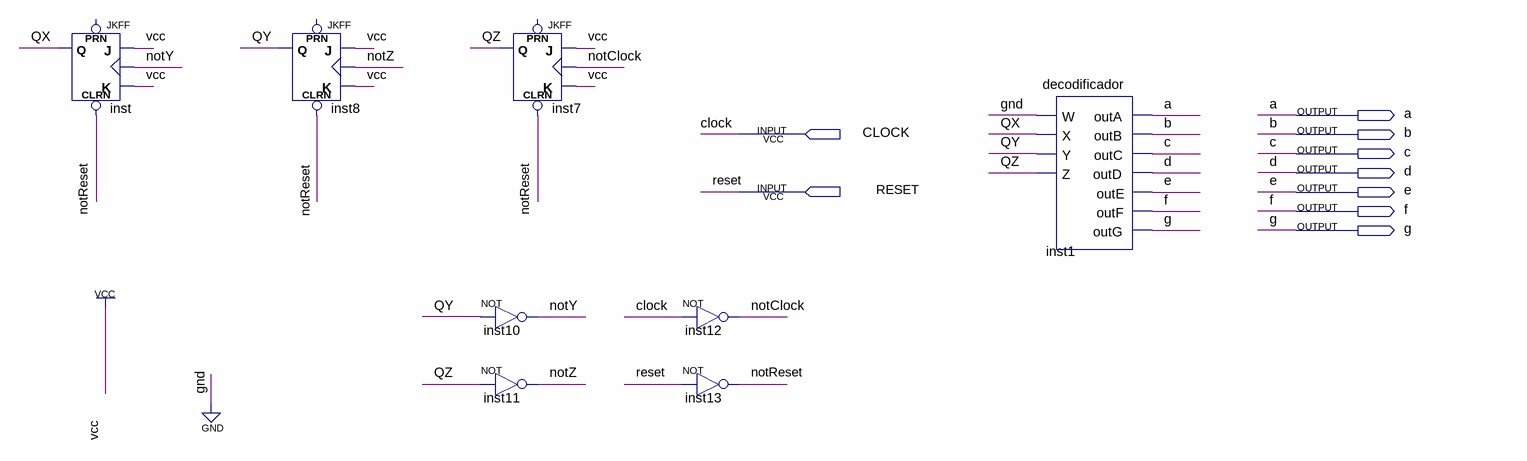
[diagram p0: schematic sheet]
// Quartus schematic ass.bdf as structural Verilog: 8 symbols, 9 pins
module ass (
  input  CLOCK,
  input  RESET,
  output a,
  output b,
  output c,
  output d,
  output e,
  output f,
  output g
);

  wire notClock, notReset, notY, notZ, QX, QY, QZ;

  JKFF inst (.CLRN(notReset), .K(1'b1), .J(1'b1), .CLK(notY), .Q(QX));  // open: PRN
  JKFF inst8 (.CLRN(notReset), .K(1'b1), .J(1'b1), .CLK(notZ), .Q(QY));  // open: PRN
  JKFF inst7 (.CLRN(notReset), .K(1'b1), .J(1'b1), .CLK(notClock), .Q(QZ));  // open: PRN
  not inst10 (notY, QY);
  not inst11 (notZ, QZ);
  not inst12 (notClock, CLOCK);
  not inst13 (notReset, RESET);
  decodificador inst1 (
    .W(1'b0), .X(QX), .Y(QY), .Z(QZ), .outA(a), .outB(b), .outC(c), .outD(d), .outE(e), .outF(f), .outG(g));
endmodule
